# EAGLE design Adafruit E-Ink Bonnet for Raspberry Pi rev B (EAGLE 9.6.2)
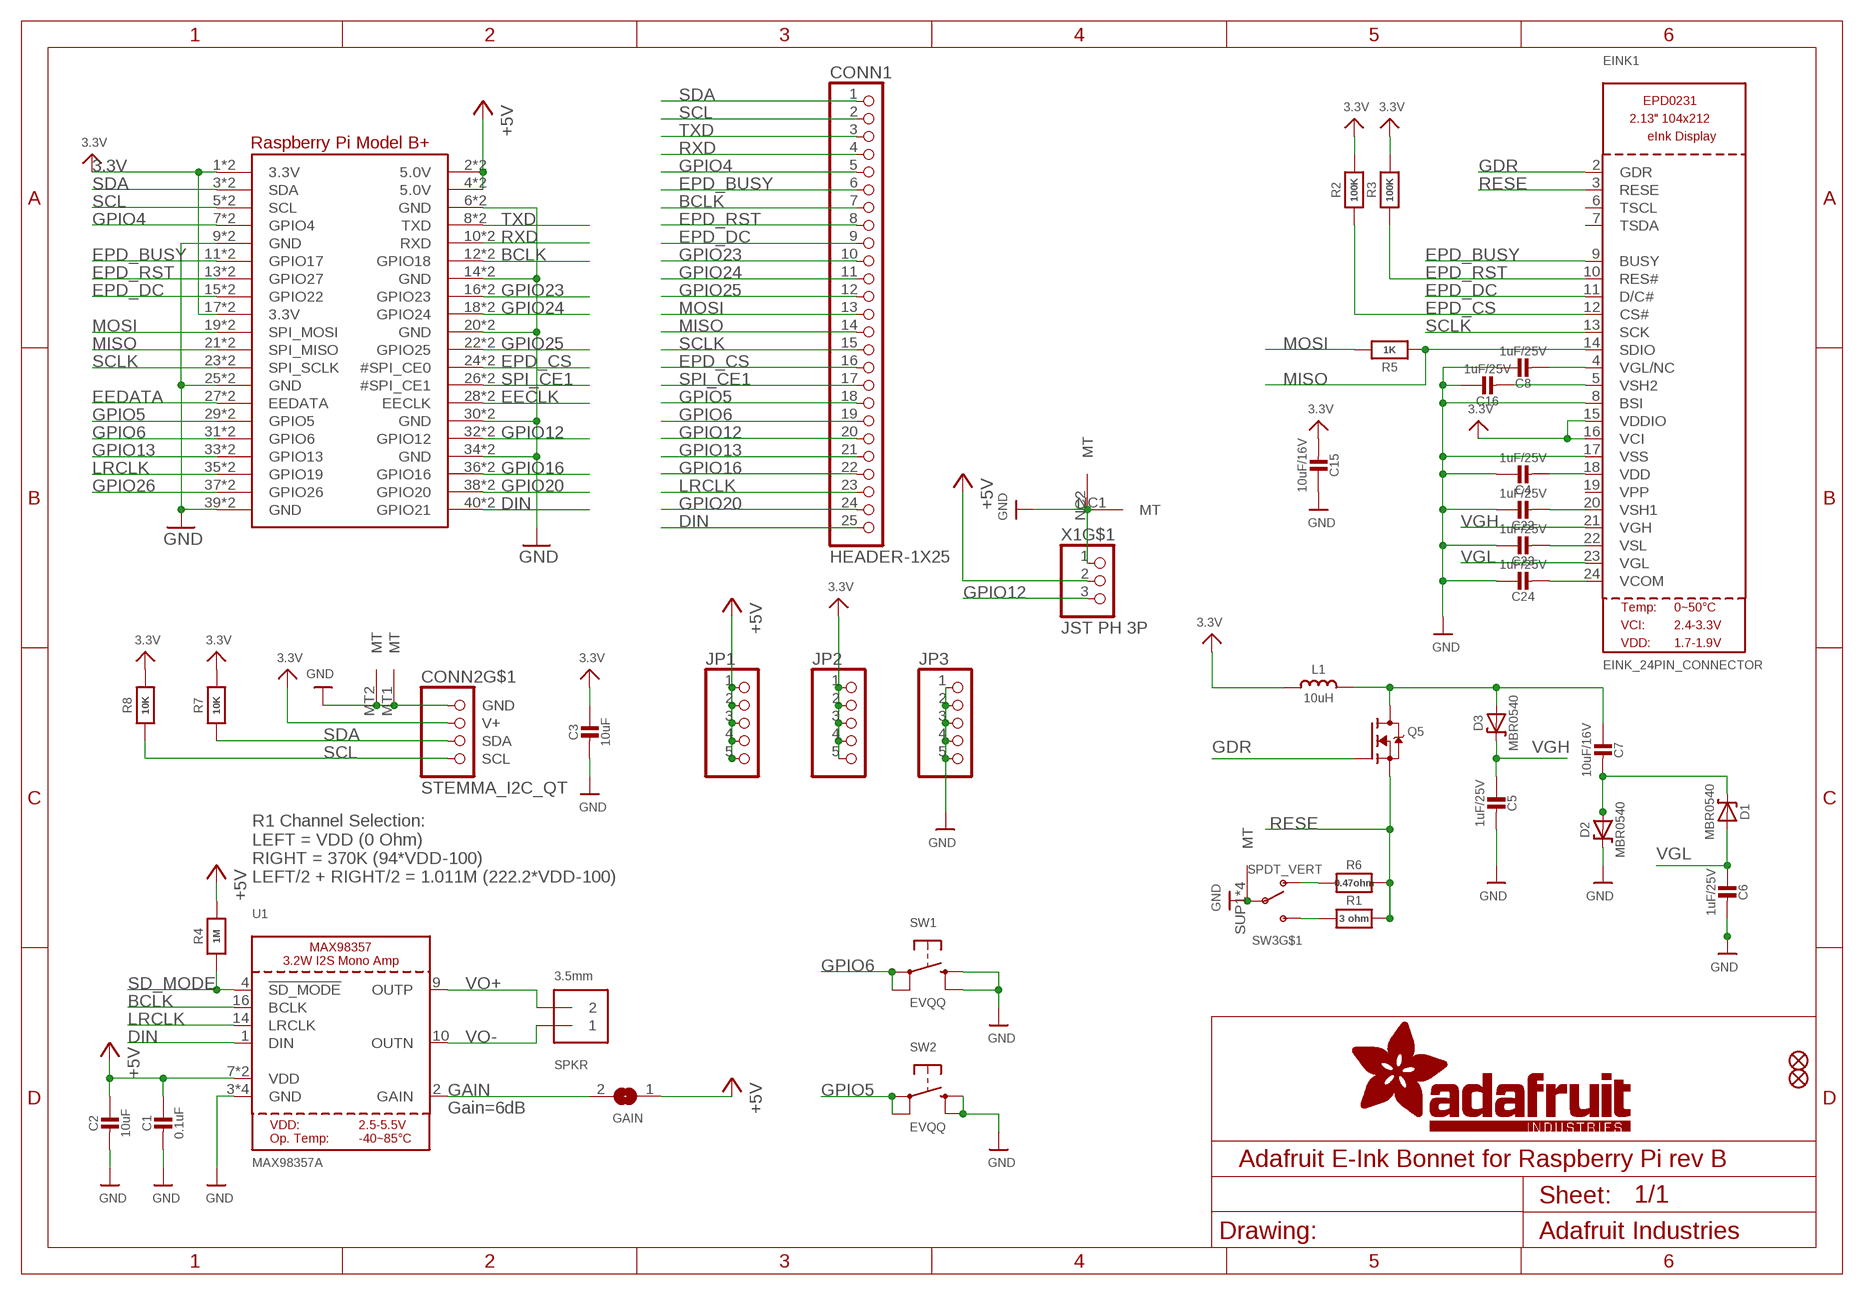
[diagram p0: schematic, sheet 1]

## Parts
C1  0.1uF  CAP_CERAMIC0603_NO  [0603-NO]
C2  10uF  CAP_CERAMIC0805-NOOUTLINE  [0805-NO]
C3  10uF  CAP_CERAMIC0805-NOOUTLINE  [0805-NO]
C4  1uF/25V  CAP_CERAMIC0603_NO  [0603-NO]
C5  1uF/25V  CAP_CERAMIC0603_NO  [0603-NO]
C6  1uF/25V  CAP_CERAMIC0603_NO  [0603-NO]
C7  10uF/16V  CAP_CERAMIC0805-NOOUTLINE  [0805-NO]
C8  1uF/25V  CAP_CERAMIC0603_NO  [0603-NO]
C15  10uF/16V  CAP_CERAMIC0805-NOOUTLINE  [0805-NO]
C16  1uF/25V  CAP_CERAMIC0603_NO  [0603-NO]
C22  1uF/25V  CAP_CERAMIC0603_NO  [0603-NO]
C23  1uF/25V  CAP_CERAMIC0603_NO  [0603-NO]
C24  1uF/25V  CAP_CERAMIC0603_NO  [0603-NO]
CONN1  HEADER-1X25  [1X25_ROUND_70MIL]
CONN2  STEMMA_I2C_QT  [JST_SH4]
D1  MBR0540  DIODE-SCHOTTKYSOD-123  [SOD-123]
D2  MBR0540  DIODE-SCHOTTKYSOD-123  [SOD-123]
D3  MBR0540  DIODE-SCHOTTKYSOD-123  [SOD-123]
EINK1  EINK_24PIN_CONNECTOR  [EINK_24PIN]
FID2  FIDUCIAL_1MM  [FIDUCIAL_1MM]
FID3  FIDUCIAL_1MM  [FIDUCIAL_1MM]
GAIN  SOLDERJUMPERCLOSED  [SOLDERJUMPER_CLOSEDWIRE]
JP1  HEADER-1X576MIL  [1X05_ROUND_76]
JP2  HEADER-1X576MIL  [1X05_ROUND_76]
JP3  HEADER-1X576MIL  [1X05_ROUND_76]
L1  10uH  INDUCTORNR401  [INDUCTOR_4X4MM_NR401]
Q5  IRLML0100  IRLML2060TRPBF  [SOT23-3]
R1  3 ohm  RESISTOR_0603_NOOUT  [0603-NO]
R2  100K  RESISTOR_0603_NOOUT  [0603-NO]
R3  100K  RESISTOR_0603_NOOUT  [0603-NO]
R4  1M  RESISTOR_0603_NOOUT  [0603-NO]
R5  1K  RESISTOR_0603_NOOUT  [0603-NO]
R6  0.47ohm  RESISTOR_0603_NOOUT  [0603-NO]
R7  10K  RESISTOR_0603_NOOUT  [0603-NO]
R8  10K  RESISTOR_0603_NOOUT  [0603-NO]
RPI1  RASPBERRYPI_BPLUS_BONNET_THMSMT  [PI_BONNET_THMSMT]
SPKR  3.5mm  TERMBLOCK_1X2_3.5MM  [TERMBLOCK_1X2-3.5MM]
SW1  EVQQ  SWITCH_TACT_SMT_6MM  [6MMX6MM_TACTILE_SMT]
SW2  EVQQ  SWITCH_TACT_SMT_6MM  [6MMX6MM_TACTILE_SMT]
SW3  SPDT_VERT  SWITCH_SPDT  [SPDT_SMT_SSSS811101]
U1  MAX98357A  AUDIOAMP_MAX98357  [QFN16_3MM]
X1  JST PH 3P  CON_JST_PH_3PIN  [JSTPH3]

## Nets
3.3V: C3.1 C15.2 CONN2.2(V+) EINK1.15(VDDIO) EINK1.16(VCI) JP2.1 JP2.2 JP2.3 JP2.4 JP2.5 L1.P$2 R2.2 R3.2 R7.1 R8.1 RPI1.1(3.3V) RPI1.17(3.3V) RPI1.S1(3.3V) RPI1.S17(3.3V)
+5V: C1.1 C2.1 GAIN.1 JP1.1 JP1.2 JP1.3 JP1.4 JP1.5 R4.2 RPI1.2(5.0V) RPI1.4(5.0V) RPI1.S2(5.0V) RPI1.S4(5.0V) U1.7(VDD) U1.8(VDD) X1.2
BCLK: CONN1.7 RPI1.12(GPIO18) RPI1.S12(GPIO18) U1.16(BCLK)
DIN: CONN1.25 RPI1.40(GPIO21) RPI1.S40(GPIO21) U1.1(DIN)
EECLK: RPI1.28(EECLK) RPI1.S28(EECLK)
EEDATA: RPI1.27(EEDATA) RPI1.S27(EEDATA)
EPD_BUSY: CONN1.6 EINK1.9(BUSY) RPI1.11(GPIO17) RPI1.S11(GPIO17)
EPD_CS: CONN1.16 EINK1.12(CS#) R2.1 RPI1.24(#SPI_CE0) RPI1.S24(#SPI_CE0)
EPD_DC: CONN1.9 EINK1.11(D/C#) RPI1.15(GPIO22) RPI1.S15(GPIO22)
EPD_RST: CONN1.8 EINK1.10(RES#) R3.1 RPI1.13(GPIO27) RPI1.S13(GPIO27)
GAIN: GAIN.2 U1.2(GAIN)
GDR: EINK1.2(GDR) Q5.1(G)
GND: C1.2 C2.2 C3.2 C4.1 C5.2 C6.2 C8.1 C15.1 C16.1 C22.1 C23.1 C24.1 CONN2.1(GND) CONN2.MT1(MT) CONN2.MT2(MT) D2.C EINK1.8(BSI) EINK1.17(VSS) JP3.1 JP3.2 JP3.3 JP3.4 JP3.5 RPI1.6(GND) RPI1.9(GND) RPI1.14(GND) RPI1.20(GND) RPI1.25(GND) RPI1.30(GND) RPI1.34(GND) RPI1.39(GND) RPI1.S6(GND) RPI1.S9(GND) RPI1.S14(GND) RPI1.S20(GND) RPI1.S25(GND) RPI1.S30(GND) RPI1.S34(GND) RPI1.S39(GND) SW1.B'(S1) SW1.B(S) SW2.B'(S1) SW2.B(S) SW3.B(P) SW3.SUP1(MT) SW3.SUP2(MT) SW3.SUP3(MT) SW3.SUP4(MT) U1.3(GND) U1.11(GND) U1.15(GND) U1.THERMAL(GND) X1.1 X1.NC1(MT) X1.NC2(MT)
GPIO4: CONN1.5 RPI1.7(GPIO4) RPI1.S7(GPIO4)
GPIO5: CONN1.18 RPI1.29(GPIO5) RPI1.S29(GPIO5) SW2.A'(P1) SW2.A(P)
GPIO6: CONN1.19 RPI1.31(GPIO6) RPI1.S31(GPIO6) SW1.A'(P1) SW1.A(P)
GPIO12: CONN1.20 RPI1.32(GPIO12) RPI1.S32(GPIO12) X1.3
GPIO13: CONN1.21 RPI1.33(GPIO13) RPI1.S33(GPIO13)
GPIO16: CONN1.22 RPI1.36(GPIO16) RPI1.S36(GPIO16)
GPIO20: CONN1.24 RPI1.38(GPIO20) RPI1.S38(GPIO20)
GPIO23: CONN1.10 RPI1.16(GPIO23) RPI1.S16(GPIO23)
GPIO24: CONN1.11 RPI1.18(GPIO24) RPI1.S18(GPIO24)
GPIO25: CONN1.12 RPI1.22(GPIO25) RPI1.S22(GPIO25)
GPIO26: RPI1.37(GPIO26) RPI1.S37(GPIO26)
LRCLK: CONN1.23 RPI1.35(GPIO19) RPI1.S35(GPIO19) U1.14(LRCLK)
MISO: CONN1.14 EINK1.14(SDIO) R5.1 RPI1.21(SPI_MISO) RPI1.S21(SPI_MISO)
MOSI: CONN1.13 R5.2 RPI1.19(SPI_MOSI) RPI1.S19(SPI_MOSI)
N$1: R1.2 SW3.C(S)
N$2: C7.2 D1.C D2.A
N$3: C7.1 D3.A L1.P$1 Q5.3(D)
N$4: C16.2 EINK1.5(VSH2)
N$5: C4.2 EINK1.18(VDD)
N$6: C22.2 EINK1.20(VSH1)
N$8: R6.2 SW3.A(O)
N$9: C8.2 EINK1.4(VGL/NC)
N$27: C23.2 EINK1.22(VSL)
N$33: C24.2 EINK1.24(VCOM)
RESE: EINK1.3(RESE) Q5.2(S) R1.1 R6.1
RXD: CONN1.4 RPI1.10(RXD) RPI1.S10(RXD)
SCL: CONN1.2 CONN2.4(SCL) R8.2 RPI1.5(SCL) RPI1.S5(SCL)
SCLK: CONN1.15 EINK1.13(SCK) RPI1.23(SPI_SCLK) RPI1.S23(SPI_SCLK)
SD_MODE: R4.1 U1.4(!SD_MODE)
SDA: CONN1.1 CONN2.3(SDA) R7.2 RPI1.3(SDA) RPI1.S3(SDA)
SPI_CE1: CONN1.17 RPI1.26(#SPI_CE1) RPI1.S26(#SPI_CE1)
TXD: CONN1.3 RPI1.8(TXD) RPI1.S8(TXD)
VGH: C5.1 D3.C EINK1.21(VGH)
VGL: C6.1 D1.A EINK1.23(VGL)
VO+: SPKR.2 U1.9(OUTP)
VO-: SPKR.1 U1.10(OUTN)
Unconnected: EINK1.6(TSCL) EINK1.7(TSDA) EINK1.19(VPP)

## Notes on the sheet
- R1 Channel Selection:
  LEFT = VDD (0 Ohm)
  RIGHT = 370K (94*VDD-100)
  LEFT/2 + RIGHT/2 = 1.011M (222.2*VDD-100)
- Gain=6dB

## Library data of the parts
C1-C8 C15 C16 C22-C24 = microbuilder:CAP_CERAMIC: Ceramic Capacitors For new designs, use the packages preceded by an '_' character since they are more reliable: The following footprints should be used on most boards: _0402 - Standard footprint for regular board layouts _0603 - Standard footprint for regular board layouts _0805 - Standard footprint for regular board layouts _1206 - Standard footprint for regular board layouts For extremely tight-pitch boards where space is at a premium, the following 'micro-pitch' footprints can be used (smaller pads, no silkscreen outline, etc.): _0402MP - Micro-pitch footprint for very dense/compact boards _0603MP - Micro-pitch footprint for very dense/compact boards _0805MP - Micro-pitch footprint for very dense/compact boards _1206MP - Micro-pitch footprint for very dense/compact boards
CONN1 = microbuilder:HEADER-1X25
CONN2 = adafruit_electromech:STEMMA_I2C; LCSC: C2845363
D1-D3 = microbuilder:DIODE-SCHOTTKY
EINK1 = adafruit_display:EINK_24PIN
FID2 FID3 = microbuilder:FIDUCIAL: Fiducial Alignment Points Various fiducial points for machine vision alignment.; BOM: EXCLUDE
GAIN = microbuilder:SOLDERJUMPER: SMD Solder JUMPER Solder the two pads together to create a connection, or remove the solder to break it. REFLOW - Use this footprint for solder paste and reflow ovens. WAVE - Use this footprint for hand-soldering (larger pads). CLOSED - Has a trace between the two pads to ensure it is closed by default. The trace needs to be cut to disable the jumper, and can be closed again by creating a solder bridge between the two pads.
JP1-JP3 = microbuilder:HEADER-1X5: PIN HEADER
L1 = microbuilder:INDUCTOR: Inductors 0603: 10nH Ceramic Inductor - microwire antenna/RF (Digikey: 712-1434-2-ND) 0805: 560nH Ceramic Inductor - RF (Digikey: 553-1047-1-ND) 270nH Ceramic Inductor - Q = 40@250MHz, +-5%, 1 Ohm DC Resistance (Digikey: 535-10506-2-ND) 1007 (2518 Metric) SMT: 10µH 10% 250mOhm 820mA 1007 Inductor (Digikey: 587-2189-1-ND) 22µH 10% 500mOhm 580mA 1007 Inductor (Digikey: 587-2190-1-ND) 47µH 10% 950mOhm 420mA 1007 Inductor (Digikey: 587-2191-1-ND) 47µH 5% 100mOhm 1A 1008 Inductor (Digikey: 732-1816-1-ND) 5.0x5.0mm (Taiyo Yuden NR5040 Series) 6.8µH 20% 2.3A 64mOhm Inductor (Digikey: 587-2374-2-ND) 5.0x5.0mm (TDK VLC5045 Series) 4.7µH 20% 3.3A 34mOhm Inductor (Digikey: 445-6526-1-ND) 6.8µH 20% 2.7A 46mOhm Inductor (Digikey: 445-6527-1-ND) 6.0x6.0mm (TDK VLC6045 Series) 4.7µH 20% 3.8A 27mOhm Inductor (Digikey: 445-6538-2-ND) 6.8µH 20% 3A 41mOhm Inductor (Digikey: 445-6540-1-ND) 6.2µH 30% 2.2A 45mOhm Inductor (Digikey: SRR5028-6R2YCT-ND) - Not TDK VLC6045 but footprint should match 6.0x6.0mm (TDK SLF6045 Series) 6.8uH 30% 2A 33mOhm Inductor (Digikey: 445-4572-1-ND, Mouser: 810-SLF645T6R8N2R0PF) 6.0x6.0mm (Sumida CDRH5D28 Series) 6.2uH 30% 1.8A 45mOhm Inductor (Digikey: 308-1542-1-ND) Taiyo Yuden NR3015T2R2M - 2.2uH 20% 1.5A (Digikey: 587-1648-2-ND, Mouser: 963-NR3015T2R2M) - Used with TI TPS62172 CoilCraft RFID Transponder Coil - MA5532-AE (For use with AS3935 Lightning Sensor) Taiyo Yuden NRH2412T2R2MNGH - 2.2uH 20% 1AA (Digikey: 587-3443-1-ND) - Used with TI LM3671 Vishay IHLP 1.0uH Molded Inductor - 24mOhm DCR, 5A, +/-20%, -55°C-125°C (Digikey: 541-1319-1-ND)
Q5 = Parts:IRLML2060TRPBF
R1-R8 = microbuilder:RESISTOR: Resistors For new designs, use the packages preceded by an '_' character since they are more reliable: The following footprints should be used on most boards: _0402 - Standard footprint for regular board layouts _0603 - Standard footprint for regular board layouts _0805 - Standard footprint for regular board layouts _1206 - Standard footprint for regular board layouts For extremely tight-pitch boards where space is at a premium, the following 'micro-pitch' footprints can be used (smaller pads, no silkscreen outline, etc.): _0402MP - Micro-pitch footprint for very dense/compact boards _0603MP - Micro-pitch footprint for very dense/compact boards _0805MP - Micro-pitch footprint for very dense/compact boards _1206MP - Micro-pitch footprint for very dense/compact boards
RPI1 = adafruit_sbc:RASPBERRYPI_BPLUS
SPKR = adafruit_electromech:TERMBLOCK_1X2: 3.5mm Terminal block http://www.ladyada.net/library/pcb/eaglelibrary.html; ROT: 0
SW1 SW2 = adafruit_electromech:SWITCH_TACT_SMT: SMT Tact Switches 6x6mm - Digikey: P12940SCT-ND KMR2 (4.6x2.8mm) - Digikey: 401-1426-1-ND EVQ-PQHB55 - Light Touch, 160GF (4.5x4.5mm) - Digikey: P8090SCT-ND KMT0 - KMT021 NGJ LHS (etc.) IP68/Waterproof - Digikey: CKN10289CT-ND
SW3 = adafruit_electromech:SWITCH_SPDT: Switch - SPDT SSSS811101 - Horizontal Two Position SMT, 0.3A 4V [Mouser: 688-SSSS811101]
U1 = microbuilder:AUDIOAMP_MAX98357: MAX98357 - 3.2W I2S Mono Audio Amp; ROT: 270
X1 = adafruit_electromech:CON_JST_PH_3PIN

## Board
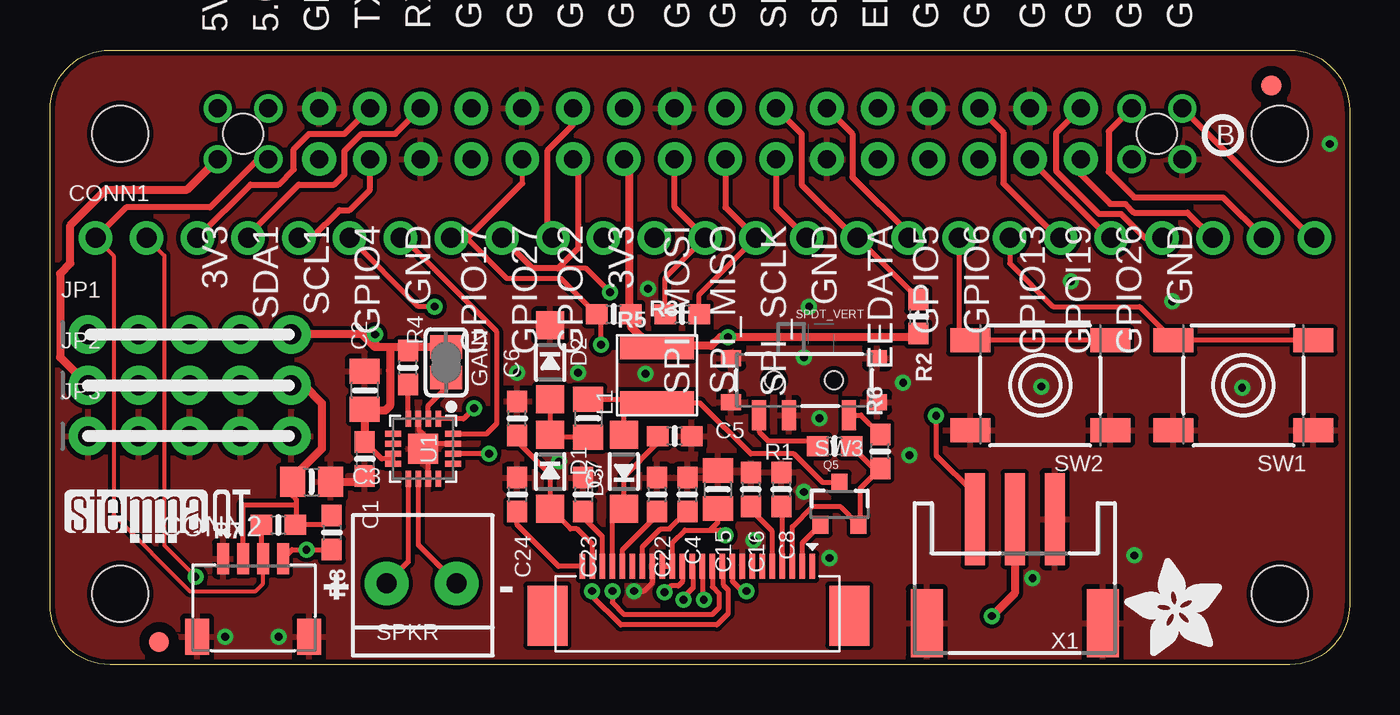
[diagram p1: board, top side]
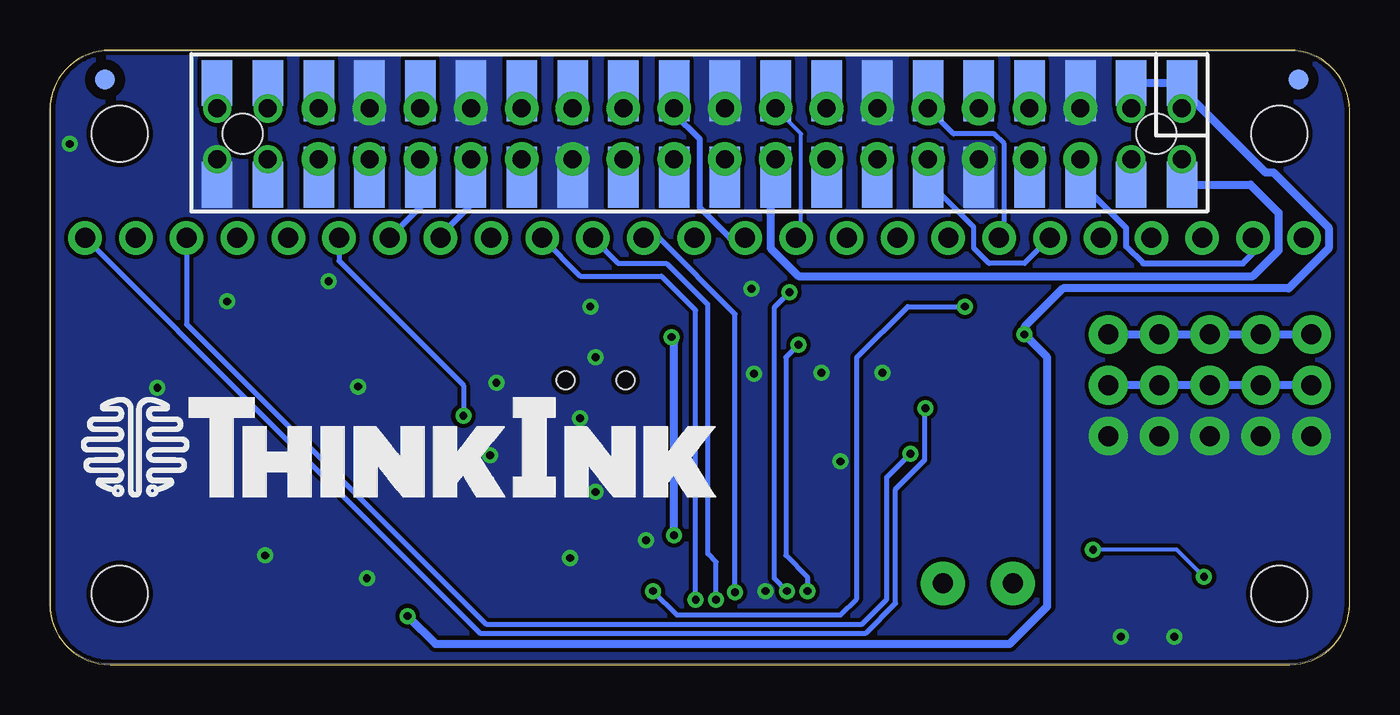
[diagram p2: board, bottom side, seen from below]

Size 65 x 30.73 mm. Coordinates in mm from the lower left corner, seen from the top.
Outline: 3,30.73 62,30.73 arc-90 65,27.73 65,3 arc-90 62,0 3,0 arc-90 0,3 0,27.73 arc-90 3,30.73
Copper layers (1*16): Top 0.035mm / dielectric 1.5mm / Bottom 0.035mm
Design rules "adafruit *": minimum track width 8mil, minimum drill 15.5mil, track to track 8mil, track to pad 8mil, pad to pad 8mil, via to via 8mil, smd to smd 8mil, copper to edge 10mil, drill to drill 8mil, minimum pad ring 10mil, minimum via ring 8mil, stop-mask expansion 2mil, vias tented up to drill 20mil, thermal gap 10mil

### Footprints (pad centres in the part's own frame; a part is rotated, then mirrored left to right if it is on the bottom)
0603-NO = smd 1.075 x 1: 1 -0.85,0; 2 0.85,0
0805-NO = smd 1.24 x 1.5: 1 -0.95,0; 2 0.95,0
1X25_ROUND_70MIL = drill 1 pad 1.676: 1 -30.48,0; 2 -27.94,0; 3 -25.4,0; 4 -22.86,0; 5 -20.32,0; 6 -17.78,0; 7 -15.24,0; 8 -12.7,0; 9 -10.16,0; 10 -7.62,0; 11 -5.08,0; 12 -2.54,0; 13 0,0; 14 2.54,0; 15 5.08,0; 16 7.62,0; 17 10.16,0; 18 12.7,0; 19 15.24,0; 20 17.78,0; 21 20.32,0; 22 22.86,0; 23 25.4,0; 24 27.94,0; 25 30.48,0
JST_SH4 = smd 0.6 x 1.55: 1 -1.5,2.006; 2 -0.5,2.006; 3 0.5,2.006; 4 1.5,2.006 | smd 1.2 x 1.8: MT1 -2.8,-1.894; MT2 2.8,-1.894
SOD-123 = smd 1.4 x 1.4: A 1.85,0; C -1.85,0
EINK_24PIN = smd 0.275 x 1.25: 1 5.75,0.98; 2 5.25,0.98; 3 4.75,0.98; 4 4.25,0.98; 5 3.75,0.98; 6 3.25,0.98; 7 2.75,0.98; 8 2.25,0.98; 9 1.75,0.98; 10 1.25,0.98; 11 0.75,0.98; 12 0.25,0.98; 13 -0.25,0.98; 14 -0.75,0.98; 15 -1.25,0.98; 16 -1.75,0.98; 17 -2.25,0.98; 18 -2.75,0.98; 19 -3.25,0.98; 20 -3.75,0.98; 21 -4.25,0.98; 22 -4.75,0.98; 23 -5.25,0.98; 24 -5.75,0.98 | smd 2 x 3: SPRT1 7.6,-1.48; SPRT2 -7.51,-1.48
FIDUCIAL_1MM = smd 1 x 1: 1 0,0
SOLDERJUMPER_CLOSEDWIRE = smd 1.168 x 1.6: 1 -0.762,0; 2 0.762,0 | smd 0.635 x 0.203: WIRE 0,0
1X05_ROUND_76 = drill 1 pad 1.93: 1 -5.08,0; 2 -2.54,0; 3 0,0; 4 2.54,0; 5 5.08,0
INDUCTOR_4X4MM_NR401 = smd 1.2 x 3.7: P$1 -1.4,0; P$2 1.4,0
SOT23-3 = smd 0.8 x 0.9: 1 -0.95,-1; 2 0.95,-1; 3 0,1.1
PI_BONNET_THMSMT = drill 0.9 pad 1.27: 1 -24.13,-1.27; 2 -24.13,1.27; 3 -21.59,-1.27; 4 -21.59,1.27; 37 21.59,-1.27; 38 21.59,1.27; 39 24.13,-1.27; 40 24.13,1.27 | drill 0.9 pad 1.676: 5 -19.05,-1.27; 6 -19.05,1.27; 7 -16.51,-1.27; 8 -16.51,1.27; 9 -13.97,-1.27; 10 -13.97,1.27; 11 -11.43,-1.27; 12 -11.43,1.27; 13 -8.89,-1.27; 14 -8.89,1.27; 15 -6.35,-1.27; 16 -6.35,1.27; 17 -3.81,-1.27; 18 -3.81,1.27; 19 -1.27,-1.27; 20 -1.27,1.27; 21 1.27,-1.27; 22 1.27,1.27; 23 3.81,-1.27; 24 3.81,1.27; 25 6.35,-1.27; 26 6.35,1.27; 27 8.89,-1.27; 28 8.89,1.27; 29 11.43,-1.27; 30 11.43,1.27; 31 13.97,-1.27; 32 13.97,1.27; 33 16.51,-1.27; 34 16.51,1.27; 35 19.05,-1.27; 36 19.05,1.27 | smd 1 x 1 bottom: 41 -29.96,2.71; 42 29.73,2.71 | smd 1.524 x 2.286 bottom: S1 -24.13,-2.542; S2 -24.13,2.538; S3 -21.59,-2.542; S4 -21.59,2.538; S37 21.59,-2.542; S38 21.59,2.538; S39 24.13,-2.542; S40 24.13,2.538 | smd 1.524 x 2.54 bottom: S5 -19.05,-2.415 | smd 1.524 x 3.048 bottom: S6 -19.05,2.157; S7 -16.51,-2.161; S8 -16.51,2.157; S9 -13.97,-2.161; S10 -13.97,2.157; S11 -11.43,-2.161; S12 -11.43,2.157; S13 -8.89,-2.161; S14 -8.89,2.157; S15 -6.35,-2.161; S16 -6.35,2.157; S17 -3.81,-2.161; S18 -3.81,2.157; S19 -1.27,-2.161; S20 -1.27,2.157; S21 1.27,-2.161; S22 1.27,2.157; S23 3.81,-2.161; S24 3.81,2.157; S25 6.35,-2.161; S26 6.35,2.157; S27 8.89,-2.161; S28 8.89,2.157; S29 11.43,-2.161; S30 11.43,2.157; S31 13.97,-2.161; S32 13.97,2.157; S33 16.51,-2.161; S34 16.51,2.157; S35 19.05,-2.161; S36 19.05,2.157 | hole 2.8: -29,0; 29,0; 29,-23; -29,-23 | hole 2: -22.86,0; 22.86,0
TERMBLOCK_1X2-3.5MM = drill 1 pad 2.184: 1 1.8,0; 2 -1.7,0
6MMX6MM_TACTILE_SMT = smd 2 x 1.2: A -3.5,-2.25; A' 3.5,-2.25; B -3.5,2.25; B' 3.5,2.25
SPDT_SMT_SSSS811101 = smd 0.7 x 1.5: A -2.25,1.242; B 0.75,1.242; C 2.25,1.242 | smd 1 x 0.8: SUP1 -3.65,0.592; SUP2 -3.65,-1.608; SUP3 3.65,0.592; SUP4 3.65,-1.608 | hole 0.9: -1.5,-0.508; 1.5,-0.508
QFN16_3MM = smd 0.8 x 0.28: 1 -1.5,0.75; 2 -1.5,0.25; 3 -1.5,-0.25; 4 -1.5,-0.75; 9 1.5,-0.75; 10 1.5,-0.25; 11 1.5,0.25; 12 1.5,0.75 | smd 0.28 x 0.8: 5 -0.75,-1.5; 6 -0.25,-1.5; 7 0.25,-1.5; 8 0.75,-1.5; 13 0.75,1.5; 14 0.25,1.5; 15 -0.25,1.5; 16 -0.75,1.5 | smd 1.5 x 1.5: THERMAL 0,0
JSTPH3 = smd 1 x 4.6: 1 -2,-2.7; 2 0,-2.7; 3 2,-2.7 | smd 1.6 x 3.4: NC1 -4.4,2.5; NC2 4.4,2.5

### Placement (x,y rotation side)
C1  15.75,10.29 270 top
C2  15.75,13.72 90 top
C3  13.08,9.14 0 top
C4  31.88,8.51 270 top
C5  31.24,11.43 0 top
C6  23.37,12.32 90 top
C7  26.92,12.32 270 top
C8  36.58,8.76 270 top
C15  33.4,8.76 270 top
C16  35.05,8.76 270 top
C22  30.35,8.51 270 top
C23  26.67,8.51 270 top
C24  23.37,8.51 270 top
CONN1  32.77,21.34 0 top
CONN2  10.16,3.3 0 top
D1  25.02,9.65 270 top
D2  25.02,15.11 270 top
D3  28.7,9.65 90 top
E$1  [THINKINK_1.25IN]  63.44,8.38 0 bottom
EINK1  32.38,3.94 0 top
FID2  61.09,28.96 0 top
FID3  5.46,1.14 0 top
GAIN  19.81,15.11 270 top
JP1  6.99,16.51 0 top
JP2  6.99,13.97 0 top
JP3  6.99,11.43 0 top
L1  30.35,14.48 90 top
PLABEL0  [PLABEL0]  34.29,16 0 top
PLABEL1  [PLABEL1]  38.86,16 0 top
PLABEL2  [PLABEL2]  46.1,12.7 90 top
PLABEL3  [PLABEL3]  64.52,12.64 90 top
PLABEL4  [PLABEL4]  56.58,4.83 0 top
PLABEL5  [PLABEL5]  2.29,19.81 0 top
PLABEL6  [PLABEL6]  7.37,19.81 0 top
PLABEL7  [PLABEL7]  12.45,19.81 0 top
PLABEL8  [PLABEL8]  17.53,19.81 0 top
PLABEL9  [PLABEL9]  22.61,19.81 0 top
PLABEL10  [PLABEL10]  27.69,19.81 0 top
PLABEL11  [PLABEL11]  32.77,19.81 0 top
PLABEL12  [PLABEL12]  37.85,19.81 0 top
PLABEL13  [PLABEL13]  42.93,19.81 0 top
PLABEL14  [PLABEL14]  48.01,19.81 0 top
PLABEL15  [PLABEL15]  53.09,19.81 0 top
PLABEL16  [PLABEL16]  58.17,19.81 0 top
PLABEL17  [PLABEL17]  63.25,19.81 0 top
PLABEL18  [PLABEL18]  4.83,22.86 0 top
PLABEL19  [PLABEL19]  9.91,22.86 0 top
PLABEL20  [PLABEL20]  14.99,22.86 0 top
PLABEL21  [PLABEL21]  20.07,22.86 0 top
PLABEL22  [PLABEL22]  25.15,22.86 0 top
PLABEL23  [PLABEL23]  30.23,22.86 0 top
PLABEL24  [PLABEL24]  35.31,22.86 0 top
PLABEL25  [PLABEL25]  40.39,22.86 0 top
PLABEL26  [PLABEL26]  45.47,22.86 0 top
PLABEL27  [PLABEL27]  50.55,22.86 0 top
PLABEL28  [PLABEL28]  55.63,22.86 0 top
PLABEL29  [PLABEL29]  60.71,22.86 0 top
PLABEL30  [PLABEL30]  13.34,16.51 0 top
PLABEL31  [PLABEL31]  13.34,13.97 0 top
PLABEL32  [PLABEL32]  13.34,11.43 0 top
PLABEL33  [PLABEL33]  21.59,15.24 90 top
PLABEL34  [PLABEL34]  42.93,4.57 90 top
PLABEL35  [PLABEL35]  16.26,8.51 0 top
PLABEL36  [PLABEL36]  63.75,15.18 0 bottom
PLABEL37  [PLABEL37]  18.67,9.14 0 bottom
PLABEL38  [PLABEL38]  53.4,0.89 0 bottom
Q5  39.5,8 0 top
R1  39.24,10.92 180 top
R2  43.43,17.4 270 top
R3  28.19,17.53 0 top
R4  17.91,14.86 90 top
R5  31.62,17.53 180 top
R6  41.53,10.67 90 top
R7  11.43,6.99 180 top
R8  14.1,6.6 270 top
RPI1  32.51,26.54 0 top
SPKR  18.54,4.06 0 top
SW1  59.69,13.97 180 top
SW2  49.53,13.97 180 top
SW3  37.72,13.72 180 top
U1  18.67,10.79 270 top
U$11  [PCBFEAT-REV-040]  58.67,26.48 0 top
U$12  [ADAFRUIT_5MM]  58.61,0.44 90 top
U$24  [STEMMAQT]  0.76,6.1 0 top
X1  48.26,4.57 180 top

### Tracks (layer width: path | path; a pad name or v marks a point on that pad's centre or on a via)
3.3V  (via drill 0.39)
  Top 0.254: EINK1.16 EINK1.15 31.14,6.12 31.75,6.73 33.02,6.73 | 33.02,6.73 33.4,7.11 C15.2 | 33.02,6.73 33.53,6.73 v33.78,6.48 | R7.1 12.32,6.99 | R8.1 13.63,6.99 12.32,6.99 | CONN2.2 9.66,8 12.32,8 | 12.32,8 12.32,8.26 12.13,8.44 C3.1 | 12.32,8 12.32,6.99
  Top 0.406: RPI1.1 6.86,23.75 2.79,23.75 1.02,21.97 1.02,20.07 0.51,19.56 0.51,15.37 JP2.1 | RPI1.17 28.96,25.02 28.96,17.61 R3.2 29.04,16.93 30.04,15.94 | 30.04,15.94 30.23,15.75 30.99,15.75 30.86,15.88 L1.P$2 | 30.04,15.94 33.08,15.94 33.53,16.38 v33.91,16.38 43.27,16.38 R2.2 | JP2.5 12.7,13.97 13.59,13.08 13.59,10.79 12.13,9.34 C3.1
  Bottom 0.406: RPI1.1 RPI1.S1 4.95,24 3.56,22.61 3.56,20.7 4.83,19.43 27.56,19.43 28.96,20.83 28.96,24.13 RPI1.S17 RPI1.17 | RPI1.1 | RPI1.17 | v33.78,6.48 33.78,16.13 33.91,16.26 v33.91,16.38 | JP2.1 JP2.2 JP2.3 JP2.4 JP2.5
+5V  (via drill 0.39)
  Top 0.254: U1.7 17.14,10.54 17.14,10.29 | C1.1 16.59,10.29 17.14,10.29 | U1.8 17.14,10.07 17.14,10.29
  Top 0.406: v16.26,16.51 16.26,16 | 16.26,16 16.26,15.88 15.62,16.51 JP1.5 | GAIN.1 17.78,15.88 | 17.78,15.88 17.02,15.88 | 17.02,15.88 16.38,15.88 16.26,16 | C2.1 15.75,12.7 | 15.75,12.7 C1.1 | 17.02,15.88 17.02,14.73 17,14.71 17,12.94 16.76,12.7 15.75,12.7 | R4.2 17.78,15.84 17.78,15.88 | X1.2 48.26,3.58 v47.12,2.43
  Bottom 0.406: RPI1.S2 RPI1.2 | RPI1.2 | RPI1.4 RPI1.S4 RPI1.S2 | RPI1.4 | RPI1.S2 8.38,28.79 4.21,24.61 3.8,24.61 1.04,21.85 1.04,20.82 3.04,18.82 14.33,18.82 16.26,16.89 v16.26,16.51 15.11,15.37 15.11,2.92 17,1.03 45.72,1.03 v47.12,2.43 | JP1.5 JP1.4 JP1.3 JP1.2 JP1.1
BCLK
  Top 0.254: U1.16 21.83,11.54 22.35,12.06 22.35,16.64 17.65,21.34 CONN1.7
  Bottom 0.254: CONN1.7 17.27,21.59 17.27,26.04 17.78,26.54 19.81,26.54 RPI1.12
  Bottom 0.406: RPI1.S12 | RPI1.S12 RPI1.12
DIN  (via drill 0.39)
  Top 0.254: v21.21,12.83 20.68,12.29 U1.1
  Top 0.305: RPI1.40 63.12,21.34 CONN1.25
  Bottom 0.254: CONN1.25 58.62,16.71 58.62,16.7 43.5,1.57 24.2,1.57 22.7,3.06 22.7,8.78 21.24,10.24 21.24,12.54 21.21,12.57 v21.21,12.83
  Bottom 0.406: RPI1.S40 RPI1.40 | RPI1.40
EECLK
  Bottom 0.406: RPI1.S28 | RPI1.S28 RPI1.28
EEDATA
  Bottom 0.406: RPI1.S27 RPI1.27 | RPI1.27
EPD_BUSY  (via drill 0.39)
  Top 0.254: EINK1.9 34.13,4.18 34.63,3.68 v34.84,3.68 | v19.24,17.91 18.41,17.91 CONN1.6
  Bottom 0.254: CONN1.6 16.26,20.07 18.03,20.07 18.8,20.83 18.8,21.88 21.08,24.17 RPI1.S11 | v34.84,3.68 33.65,2.49 25.45,2.49 24.64,3.3 24.64,15.37 22.1,17.91 v19.24,17.91
  Bottom 0.406: RPI1.S11 RPI1.11 | RPI1.11
EPD_CS  (via drill 0.39)
  Top 0.254: EINK1.12 32.63,3.31 v32.7,3.24 | CONN1.16 43.43,18.29 R2.1
  Top 0.305: RPI1.24 37.59,26.54 37.59,24 40.26,21.34 CONN1.16
  Bottom 0.254: v32.7,3.24 32.7,17.72 34.42,19.43 38.48,19.43 CONN1.16
  Bottom 0.406: RPI1.S24 | RPI1.S24 RPI1.24
EPD_DC  (via drill 0.39)
  Top 0.254: EINK1.11 33.13,3.88 33.47,3.56 33.47,2.86 33.12,2.51 28.73,2.51 28.13,3.11 v28.13,3.68 | v28.01,18.62 26.82,19.81 25.4,19.81 | RPI1.15 26.42,25.02
  Top 0.305: 26.42,25.02 26.42,20.83 25.4,19.81 24.13,19.81 CONN1.9
  Bottom 0.254: v28.13,3.68 28.77,4.32 28.77,17.87 v28.01,18.62 | RPI1.15 26.16,24.77 26.73,24.19 26.73,23.88 26.23,24.38 RPI1.S15
  Bottom 0.406: RPI1.15
EPD_RST  (via drill 0.39)
  Top 0.254: EINK1.10 33.67,4.88 33.67,4 33.92,3.75 33.92,2.55 33.36,1.99 28.56,1.99 27.11,3.43 v27.11,3.68 | v27.56,16 27.56,17.31 R3.1 25.57,19.3 22.86,19.3 20.83,21.34 CONN1.8 | RPI1.13 23.62,24.07
  Top 0.305: 23.62,24.07 20.89,21.34 CONN1.8
  Bottom 0.254: v27.11,3.68 27.11,4.38 28.19,5.46 28.19,15.37 v27.56,16 | RPI1.S13 RPI1.13 | RPI1.13
GAIN
  Top 0.254: U1.2 18.92,12.95 19.81,13.84 GAIN.2
GDR
  Top 0.254: EINK1.2 37.63,6.09 Q5.1
GND  (via drill 0.39)
  Top 0.254: U1.11 18.92,10.54 U1.THERMAL 18.67,10.92 | U1.3 18.45,12.27 18.45,11.76 18.67,11.54 18.67,10.92 | U1.15 18.79,11.04 18.67,10.92 | EINK1.17 30.14,4.1 29.72,3.68 v29.21,3.68
  Top 0.406: C3.2 15.46,9.14 C1.2
  Bottom 0.406: RPI1.S9 RPI1.9 | RPI1.9
  other vias: 38.48,12.32 38.99,5.33 25.46,10.16 26.42,14.61 23.37,14.61 42.67,14.1 49.15,4.32 54.23,5.46 35.18,6.22 11.43,1.4 8.76,1.4 64.01,26.04 56.13,18.16 51.05,19.18 42.99,10.48 37.97,17.91 37.72,15.37 37.72,8.64 29.78,14.54 29.91,18.8 49.59,13.91 59.63,13.84
  pour Top: 0,30.73 0,0 65.02,0 65.02,30.73
  pour Bottom (no thermals): 0,30.73 0,0.13 65.02,0 65.02,30.73
GPIO4
  Top 0.305: CONN1.5 13.08,21.34 14.48,22.73 14.99,22.73 16,23.75 RPI1.7
  Bottom 0.406: RPI1.S7 RPI1.7
GPIO5
  Top 0.254: SW2.A SW2.A' 45.47,16.78 CONN1.18
  Bottom 0.305: RPI1.S29 43.94,22.99 45.47,21.46 CONN1.18
  Bottom 0.406: RPI1.S29 RPI1.29 | RPI1.29
GPIO6
  Top 0.254: SW1.A SW1.A' 54.5,17.91 50.16,17.91 48.01,20.07 CONN1.19
  Bottom 0.305: RPI1.S31 46.48,22.86 CONN1.19
  Bottom 0.406: RPI1.S31 RPI1.31 | RPI1.31
GPIO12  (via drill 0.39)
  Top 0.254: v44.32,12.45 44.32,10.48 46.26,8.54 X1.3
  Top 0.305: RPI1.32 47.68,26.62 47.68,24.08 50.42,21.34 CONN1.20
  Bottom 0.254: CONN1.20 50.55,20.19 44.32,13.97 v44.32,12.45
  Bottom 0.406: RPI1.S32 | RPI1.S32 RPI1.32
GPIO13
  Top 0.305: RPI1.33 52.96,21.34 CONN1.21
  Bottom 0.406: RPI1.S33 RPI1.33 | RPI1.33
GPIO16
  Top 0.305: CONN1.22 54.77,21.34 53.58,22.53 52.48,22.53 50.33,24.68 50.33,26.59 RPI1.36
  Bottom 0.406: RPI1.S36 | RPI1.S36 RPI1.36
GPIO20
  Top 0.305: RPI1.38 52.96,26.67 52.96,24.64 54.23,23.37 58.67,23.37 CONN1.24
  Bottom 0.406: RPI1.S38 | RPI1.S38 RPI1.38
GPIO23
  Top 0.305: CONN1.10 24.89,21.59 24.89,25.72 26.16,26.99 RPI1.16
  Bottom 0.406: RPI1.S16 | RPI1.S16 RPI1.16
GPIO24
  Bottom 0.203: CONN1.11 27.43,21.59 27.43,26.54 RPI1.18
  Bottom 0.406: RPI1.S18 | RPI1.S18 RPI1.18
GPIO25
  Bottom 0.254: RPI1.S22 | RPI1.S22 RPI1.22 | RPI1.S22 33.78,27.56
  Bottom 0.305: CONN1.12 30.99,21.34 32.51,22.86 32.51,26.29 33.78,27.56
GPIO26
  Bottom 0.406: RPI1.S37 RPI1.37 | RPI1.37
LRCLK  (via drill 0.39)
  Top 0.254: v21.97,10.54 U1.14
  Top 0.305: RPI1.35 51.56,24.51 53.03,23.04 53.79,23.04 54.22,22.61 56.9,22.61 CONN1.23
  Bottom 0.254: CONN1.23 58.17,17.02 43.18,2.03 24.38,2.03 23.16,3.25 23.16,9.35 v21.97,10.54
  Bottom 0.406: RPI1.S35 RPI1.35 | RPI1.35
MISO  (via drill 0.39)
  Top 0.254: EINK1.14 31.64,4.14 31.43,3.94 31.05,3.94 v30.73,3.62 | R5.1 32.47,18.5 CONN1.14
  Top 0.305: RPI1.21 33.78,22.86 CONN1.14
  Bottom 0.254: v30.73,3.62 30.73,17.53 34.54,21.34 CONN1.14
  Bottom 0.406: RPI1.S21 RPI1.21 | RPI1.21
MOSI
  Top 0.254: R5.2 30.77,19.34 CONN1.13
  Top 0.305: CONN1.13 31.24,22.86 RPI1.19
  Bottom 0.406: RPI1.S19 RPI1.19 | RPI1.19
N$1
  Top 0.254: SW3.C 35.47,11.65 35.94,11.18 38.14,11.18 R1.2
N$2
  Top 0.254: C7.2 25.15,11.37 D1.C D2.A
N$3
  Top 0.254: Q5.3 38.65,9.1 37.21,10.54 35.05,10.54 32.52,13.08 L1.P$1 30.22,13.21 29.08,13.21 | D3.A 28.7,12.83 29.08,13.21 | C7.1 29.02,13.27 29.08,13.21
N$4
  Top 0.254: EINK1.5 36.13,6.66 35.05,7.75 C16.2
N$5
  Top 0.254: EINK1.18 29.64,5.89 30.54,6.79 30.99,6.79 31.86,7.66 C4.2
N$6
  Top 0.254: EINK1.20 28.64,5.74 30.35,7.46 C22.2
N$8
  Top 0.254: SW3.A 40.57,12.47 R6.2
N$9
  Top 0.254: EINK1.4 36.63,7.85 C8.2
N$27
  Top 0.254: EINK1.22 27.64,6.4 26.67,7.37 C23.2
N$33
  Top 0.254: EINK1.24 25.44,4.92 23.37,6.99 C24.2
RESE
  Top 0.254: EINK1.3 37.13,6.91 38.12,7.89 39.56,7.89 Q5.2 40.51,7.07 40.51,8.8 R6.1 41.2,9.82 R1.1
RXD
  Top 0.305: CONN1.4 9.91,21.46 12.45,24 14.22,24 14.73,24.51 14.73,25.69 15.58,26.54 17.27,26.54 RPI1.10
  Bottom 0.406: RPI1.S10 | RPI1.S10 RPI1.10
SCL  (via drill 0.39)
  Top 0.203: CONN1.2 5.71,20.45 5.71,5.97 7.28,4.41 v7.28,4.39
  Top 0.254: CONN2.4 12.11,5.75 v12.83,5.75 R8.2
  Bottom 0.203: v7.28,4.39 8.64,5.75 v12.83,5.75
  Bottom 0.305: RPI1.S5 11.18,21.84 11.18,20.92 10.32,20.07 5.33,20.07 4.83,20.57 CONN1.2
  Bottom 0.406: RPI1.S5 RPI1.5
SCLK  (via drill 0.39)
  Top 0.254: EINK1.13 32.17,4.88 32.17,3.85 31.69,3.37 v31.69,3.24
  Top 0.305: RPI1.23 36.32,22.86 CONN1.15
  Bottom 0.254: v31.69,3.24 31.69,5.13 32.1,5.54 32.1,18 34.16,20.07 36.58,20.07 CONN1.15
  Bottom 0.406: RPI1.S23 RPI1.23 | RPI1.23
SD_MODE
  Top 0.254: U1.4 17.92,13.51 R4.1
SDA
  Top 0.203: CONN1.1 3.17,20.45 3.17,7.49 6.99,3.68 10.29,3.68 10.66,4.06 CONN2.3
  Top 0.254: CONN2.3 10.58,5.39 R7.2
  Top 0.305: RPI1.3 10.41,25.27 8,22.86 3.81,22.86 CONN1.1
  Bottom 0.406: RPI1.S3 RPI1.3
SPI_CE1
  Top 0.305: RPI1.26 40.13,26.54 40.13,24.38 42.93,21.59 CONN1.17
  Bottom 0.406: RPI1.S26 | RPI1.S26 RPI1.26
TXD
  Top 0.305: CONN1.3 10.03,24 11.43,24 12.19,24.77 12.19,25.78 12.95,26.54 14.73,26.54 RPI1.8
  Bottom 0.406: RPI1.S8 | RPI1.S8 RPI1.8
VGH
  Top 0.254: EINK1.21 28.14,7.24 D3.C 28.7,9.4 30.39,11.09 C5.1
VGL
  Top 0.254: EINK1.23 27.14,6.01 26.36,6.79 26.03,6.79 D1.A | D1.A | C6.1 23.37,11.18 25.02,9.52 D1.A
VO+
  Top 0.254: U1.9 17.92,5.14 SPKR.2
VO-
  Top 0.254: U1.10 18.42,5.99 SPKR.1

### Text on the board
tPlace: + | -
Pinguin_tBackup: SCL | RXD | BUSY | ERST | IO23 | IO25 | MISO | ECS | IO5 | IO12 | IO16 | IO20 | SDA | TXD | IO4 | BCLK | EDC | IO24 | MOSI | SCLK | CE1 | IO6 | IO13 | LRC | I2S | 5 | 3Ω | 0.5Ω | Gain | 3 | #5 | #6 | G | Adafruit / E-Ink / Bonnet | Speaker | #12
Pinguin_bBackup: Adafruit E-Ink / E-Paper Bonnet / For Standard 24-pin Displays | I2S Speaker / BCLK: 18 / LRCLK: 19 / DIN: 21 | EPD on SPI + D/C: 22, Reset: 27, Busy: 17